# EAGLE schematic GreenHouseControler (EAGLE 7.5.0)
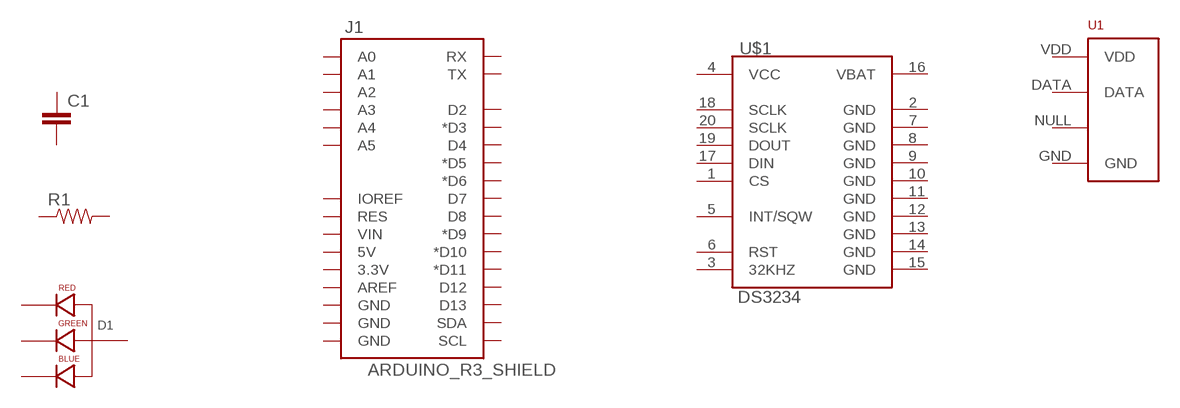
[diagram p0: schematic, sheet 1]

## Parts
C1  CAP0805  [0805]
D1  LED-RGB-CA-THRUDIFFUSE  [LED-RGB-THRU]
J1  ARDUINO_R3_SHIELD  [UNO_R3_SHIELD]
R1  RESISTOR0805-RES  [0805]
U1  RHT03_DHT-22_AM2302RA  [RHT03_DHT-22/RA]
U$1  DS3234  [DS3234]
Unconnected: C1.1 C1.2 D1.1(RED_CATHODE) D1.2(ANODE) D1.3(GREEN_CATHODE) D1.4(BLUE_CATHODE) J1.3.3V J1.5V J1.A0 J1.A1 J1.A2 J1.A3 J1.A4 J1.A5 J1.AREF J1.D2 J1.D3(*D3) J1.D4 J1.D5(*D5) J1.D6(*D6) J1.D7 J1.D8 J1.D9(*D9) J1.D10(*D10) J1.D11(*D11) J1.D12 J1.D13 J1.GND@0(GND) J1.GND@1(GND) J1.GND@2(GND) J1.IOREF J1.RES J1.RX J1.SCL J1.SDA J1.TX J1.VIN R1.1 R1.2 U1.DATA U1.NULL U$1.1(CS) U$1.2(GND) U$1.3(32KHZ) U$1.4(VCC) U$1.5(INT/SQW) U$1.6(RST) U$1.7(GND) U$1.8(GND) U$1.9(GND) U$1.10(GND) U$1.11(GND) U$1.12(GND) U$1.13(GND) U$1.14(GND) U$1.15(GND) U$1.16(VBAT) U$1.17(DIN) U$1.18(SCLK) U$1.19(DOUT) U$1.20(SCLK)

## Power pins joined to a net without a drawn wire
GND: U1.GND
VDD: U1.VDD

## Library data of the parts
C1 = SparkFun-Passives:CAP: Capacitor Standard 0603 ceramic capacitor, and 0.1" leaded capacitor.
D1 = SparkFun-LED:LED-RGB-CA-THRU: RGB Through-hole common anode SparkFun store front COM-10821 (diffuse) COM-10820 (clear); PROD_ID: DIO-10632
J1 = SparkFun-Boards:ARDUINO_R3_SHIELD: Shield form compatible with the Arduino Uno R3.
R1 = SparkFun-Passives:RESISTOR: Resistor Basic schematic elements and footprints for 0603, 1206, and PTH resistors.
U1 = RHT03_DHT-22_AM2302:RHT03_DHT-22_AM2302: RHT03 / DHT-22 / AM2302 Packages and symbol for the RHT03 / DHT-22 relative humidity and temperature sensor. Note: The AM2302 is a wired version of the DHT-22 which typically requires less clearance and is thus provided as a separate package.; PROD_ID: SEN-10167
U$1 = SparkFun-FreqCtrl:DS3234: SPI RTC module with battery backup and internal clock.